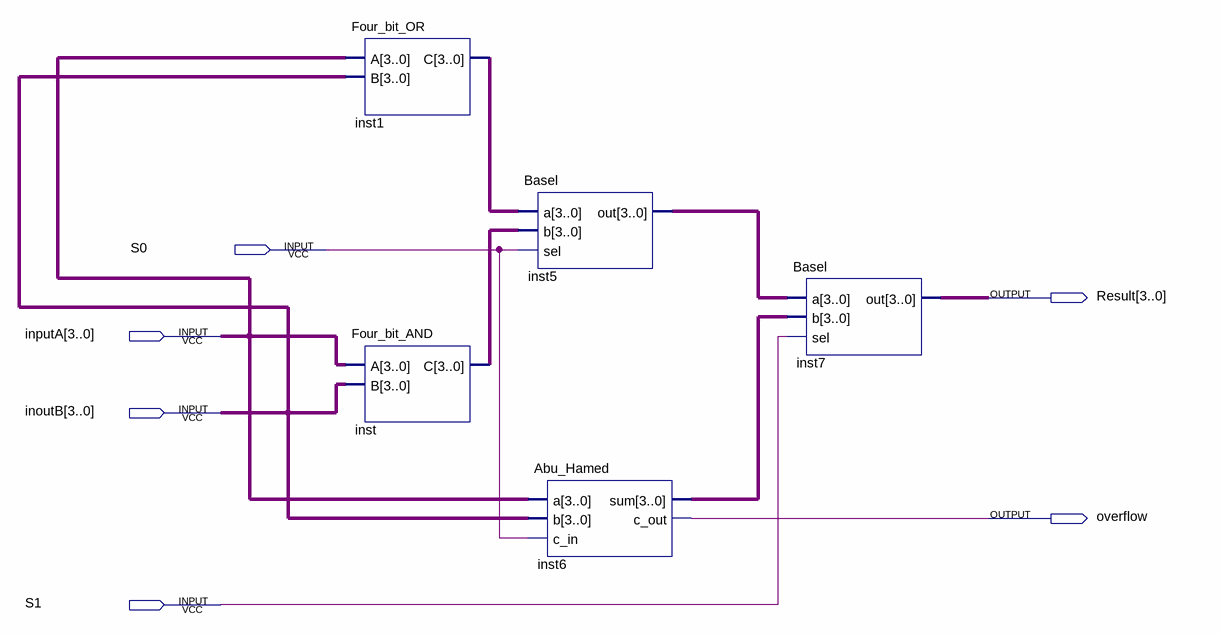
[diagram p0: schematic sheet]
// Quartus schematic BlockDigram_1202397.bdf as structural Verilog: 5 symbols, 6 pins
module BlockDigram_1202397 (
  input  S0,
  input  [3:0] inputA,
  input  [3:0] inoutB,
  input  S1,
  output [3:0] Result,
  output overflow
);

  wire [3:0] inst1_c, inst5_out, inst6_sum, inst_c;

  Four_bit_OR inst1 (.A(inputA), .B(inoutB), .C(inst1_c));
  Four_bit_AND inst (.A(inputA), .B(inoutB), .C(inst_c));
  Basel inst5 (.a(inst1_c), .b(inst_c), .sel(S0), .out(inst5_out));
  Abu_Hamed inst6 (.a(inputA), .b(inoutB), .c_in(S0), .sum(inst6_sum), .c_out(overflow));
  Basel inst7 (.a(inst5_out), .b(inst6_sum), .sel(S1), .out(Result));
endmodule
